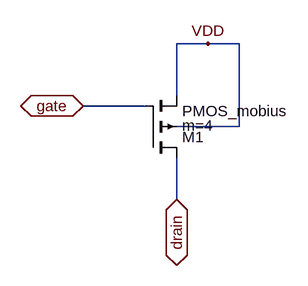
[diagram p0: schematic CS_pMOS_4x_A.asc]
CS_pMOS_4x_A.asc, the LTspice schematic file:
Version 4
SHEET 1 880 680
WIRE 256 176 208 176
WIRE 304 176 256 176
WIRE 208 256 208 176
WIRE 160 272 64 272
WIRE 304 304 304 176
WIRE 304 304 208 304
WIRE 208 416 208 352
FLAG 208 416 drain
IOPIN 208 416 BiDir
FLAG 64 272 gate
IOPIN 64 272 BiDir
FLAG 256 176 VDD
SYMBOL pmos4 160 352 M180
WINDOW 123 56 50 Left 2
SYMATTR Value2 m=4
SYMATTR InstName M1
SYMATTR Value PMOS_mobius
SYMATTR Prefix X

The netlist it stands for:
* CS_pMOS_4x_A.asc
XM1 drain gate VDD VDD PMOS_mobius m=4  ; pins D G S B
.backanno
.end